# Altium schematic sheet FPGA Power.SCHDOC
size A
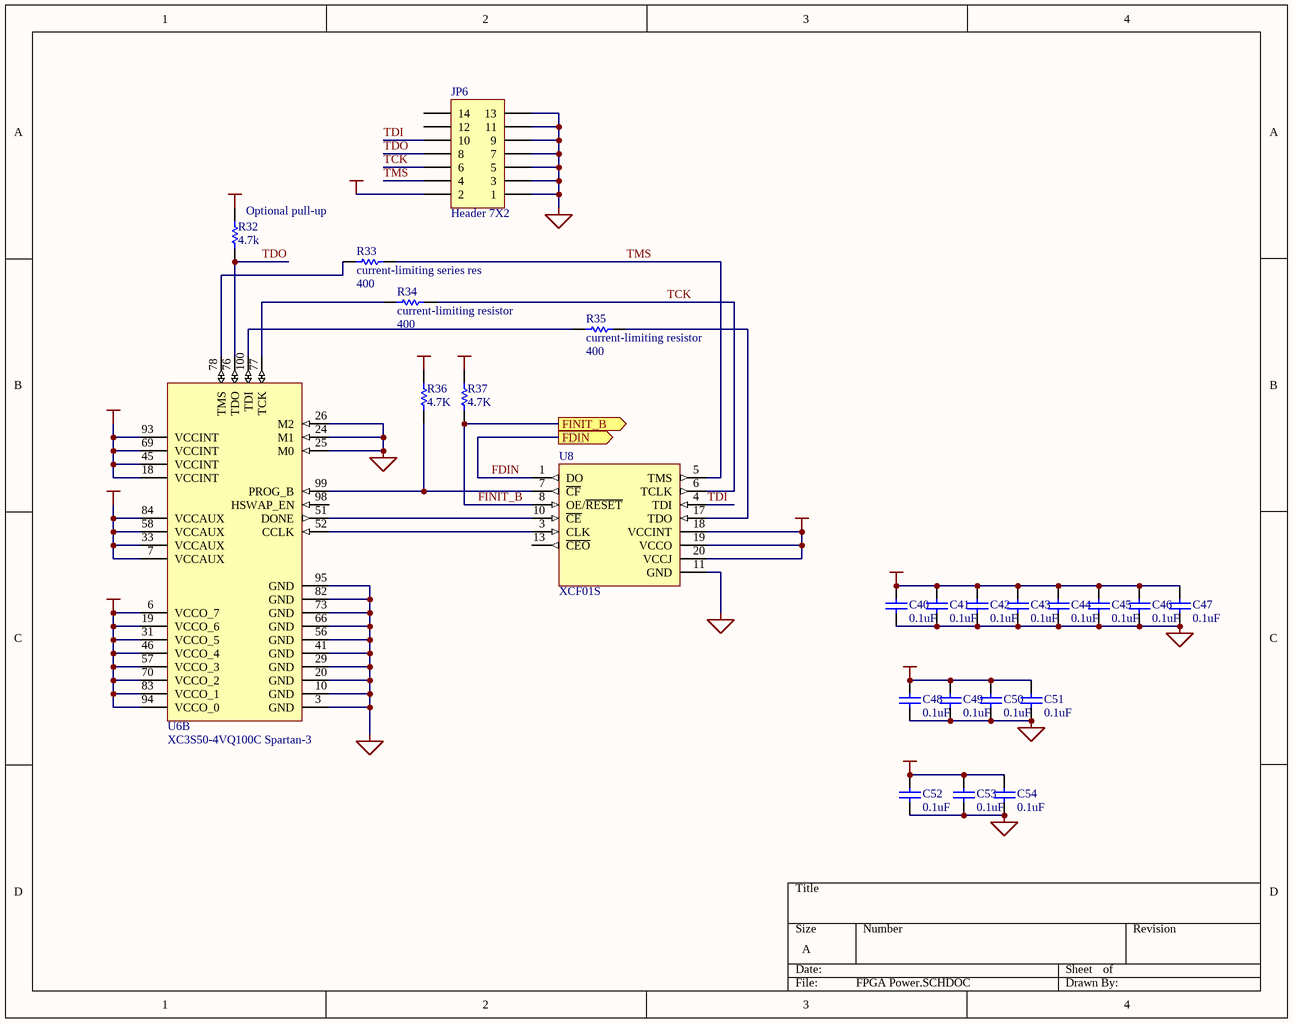
[diagram p0: FPGA Power.SCHDOC]

## Parts
C40  value 0.1uF  [CC1608-0603]  (hidden comment: Cap)
C41  value 0.1uF  [CC1608-0603]  (hidden comment: Cap)
C42  value 0.1uF  [CC1608-0603]  (hidden comment: Cap)
C43  value 0.1uF  [CC1608-0603]  (hidden comment: Cap)
C44  value 0.1uF  [CC1608-0603]  (hidden comment: Cap)
C45  value 0.1uF  [CC1608-0603]  (hidden comment: Cap)
C46  value 0.1uF  [CC1608-0603]  (hidden comment: Cap)
C47  value 0.1uF  [CC1608-0603]  (hidden comment: Cap)
C48  value 0.1uF  [CC1608-0603]  (hidden comment: Cap)
C49  value 0.1uF  [CC1608-0603]  (hidden comment: Cap)
C50  value 0.1uF  [CC1608-0603]  (hidden comment: Cap)
C51  value 0.1uF  [CC1608-0603]  (hidden comment: Cap)
C52  value 0.1uF  [CC1608-0603]  (hidden comment: Cap)
C53  value 0.1uF  [CC1608-0603]  (hidden comment: Cap)
C54  value 0.1uF  [CC1608-0603]  (hidden comment: Cap)
JP6  Header 7X2  [HDR2x7-2mm]
R32  Optional pull-up  value 4.7k  [CC1608-0603]
R33  current-limiting series res  value 400  [CC1608-0603]
R34  current-limiting resistor  value 400  [CC1608-0603]
R35  current-limiting resistor  value 400  [CC1608-0603]
R36  value 4.7K  [CC1608-0603]  (hidden comment: Res1)
R37  value 4.7K  [CC1608-0603]  (hidden comment: Res1)
U6  XC3S50-4VQ100C Spartan-3  [Xilinx TQ100]  (part B of 2)
U8  XCF01S  [TSSO6x6-G20/X.3]

## Ports
FDIN (out), FINIT_B (out)

## Nets
+1.2VCC: C48.1 C49.1 C50.1 C51.1 U6.18(VCCINT) U6.45(VCCINT) U6.69(VCCINT) U6.93(VCCINT)
+2.5VCC: C52.1 C53.1 C54.1 U6.7(VCCAUX) U6.33(VCCAUX) U6.58(VCCAUX) U6.84(VCCAUX)
GND: C40.2 C41.2 C42.2 C43.2 C44.2 C45.2 C46.2 C47.2 C48.2 C49.2 C50.2 C51.2 C52.2 C53.2 C54.2 JP6.1 JP6.3 JP6.5 JP6.7 JP6.9 JP6.11 JP6.13 U6.3(GND) U6.10(GND) U6.20(GND) U6.24(M1) U6.25(M0) U6.26(M2) U6.29(GND) U6.41(GND) U6.56(GND) U6.66(GND) U6.73(GND) U6.82(GND) U6.95(GND) U8.11(GND)
VCC: C40.1 C41.1 C42.1 C43.1 C44.1 C45.1 C46.1 C47.1 JP6.2 R32.2 R36.2 R37.2 U6.6(VCCO_7) U6.19(VCCO_6) U6.31(VCCO_5) U6.46(VCCO_4) U6.57(VCCO_3) U6.70(VCCO_2) U6.83(VCCO_1) U6.94(VCCO_0) U8.18(VCCINT) U8.19(VCCO) U8.20(VCCJ)
FDIN: U8.1(DO) ; port FDIN
FINIT_B: R37.1 U8.8(OE/~{RESET}) ; port FINIT_B
TCK: JP6.6 R34.1 U8.6(TCLK)
TDI: JP6.10 U8.4(TDI)
TDO: JP6.8 R32.1 U6.76(TDO)
TMS: JP6.4 R33.1 U8.5(TMS)
NetR33_2: R33.2 U6.78(TMS)
NetR34_2: R34.2 U6.77(TCK)
NetR35_1: R35.1 U8.17(TDO)
NetR35_2: R35.2 U6.100(TDI)
NetR36_1: R36.1 U6.99(PROG_B) U8.7(~{CF})
NetU6_51: U6.51(DONE) U8.10(~{CE})
NetU6_52: U6.52(CCLK) U8.3(CLK)

Not connected (* = marked no-connect by the designer): JP6 12 14; U6 98(HSWAP_EN); U8 13(~{CEO})

## Library data of the parts
C40-C54 = Cap: Capacitor; Manufacturer: Generic Components; Class I: Passive; Published: 8-Jun-2000; Revision: July-2002: Re-released for DXP Platform.; Publisher: Altium Limited; Class II: Capacitor
JP6 = Header 7X2: Header, 7-Pin, Dual row; Manufacturer: Generic Components; Class I: Connector; Revision: July-2002: Re-released for DXP Platform.; Publisher: Altium Limited
R32-R37 = Res1: Resistor; Manufacturer: Generic Components; Class I: Passive; Published: 8-Jun-2000; Revision: July-2002: Re-released for DXP Platform.; Publisher: Altium Limited; Class II: Resistor
U6 = XC3S50-4VQ100C: Xilinx Spartan-3 VQ100; Vendor: Xilinx
U8 = XCF01S: Xilinx Platform Flash; Vendor: Xilinx